# EAGLE design eled01 (EAGLE 7.2.0)
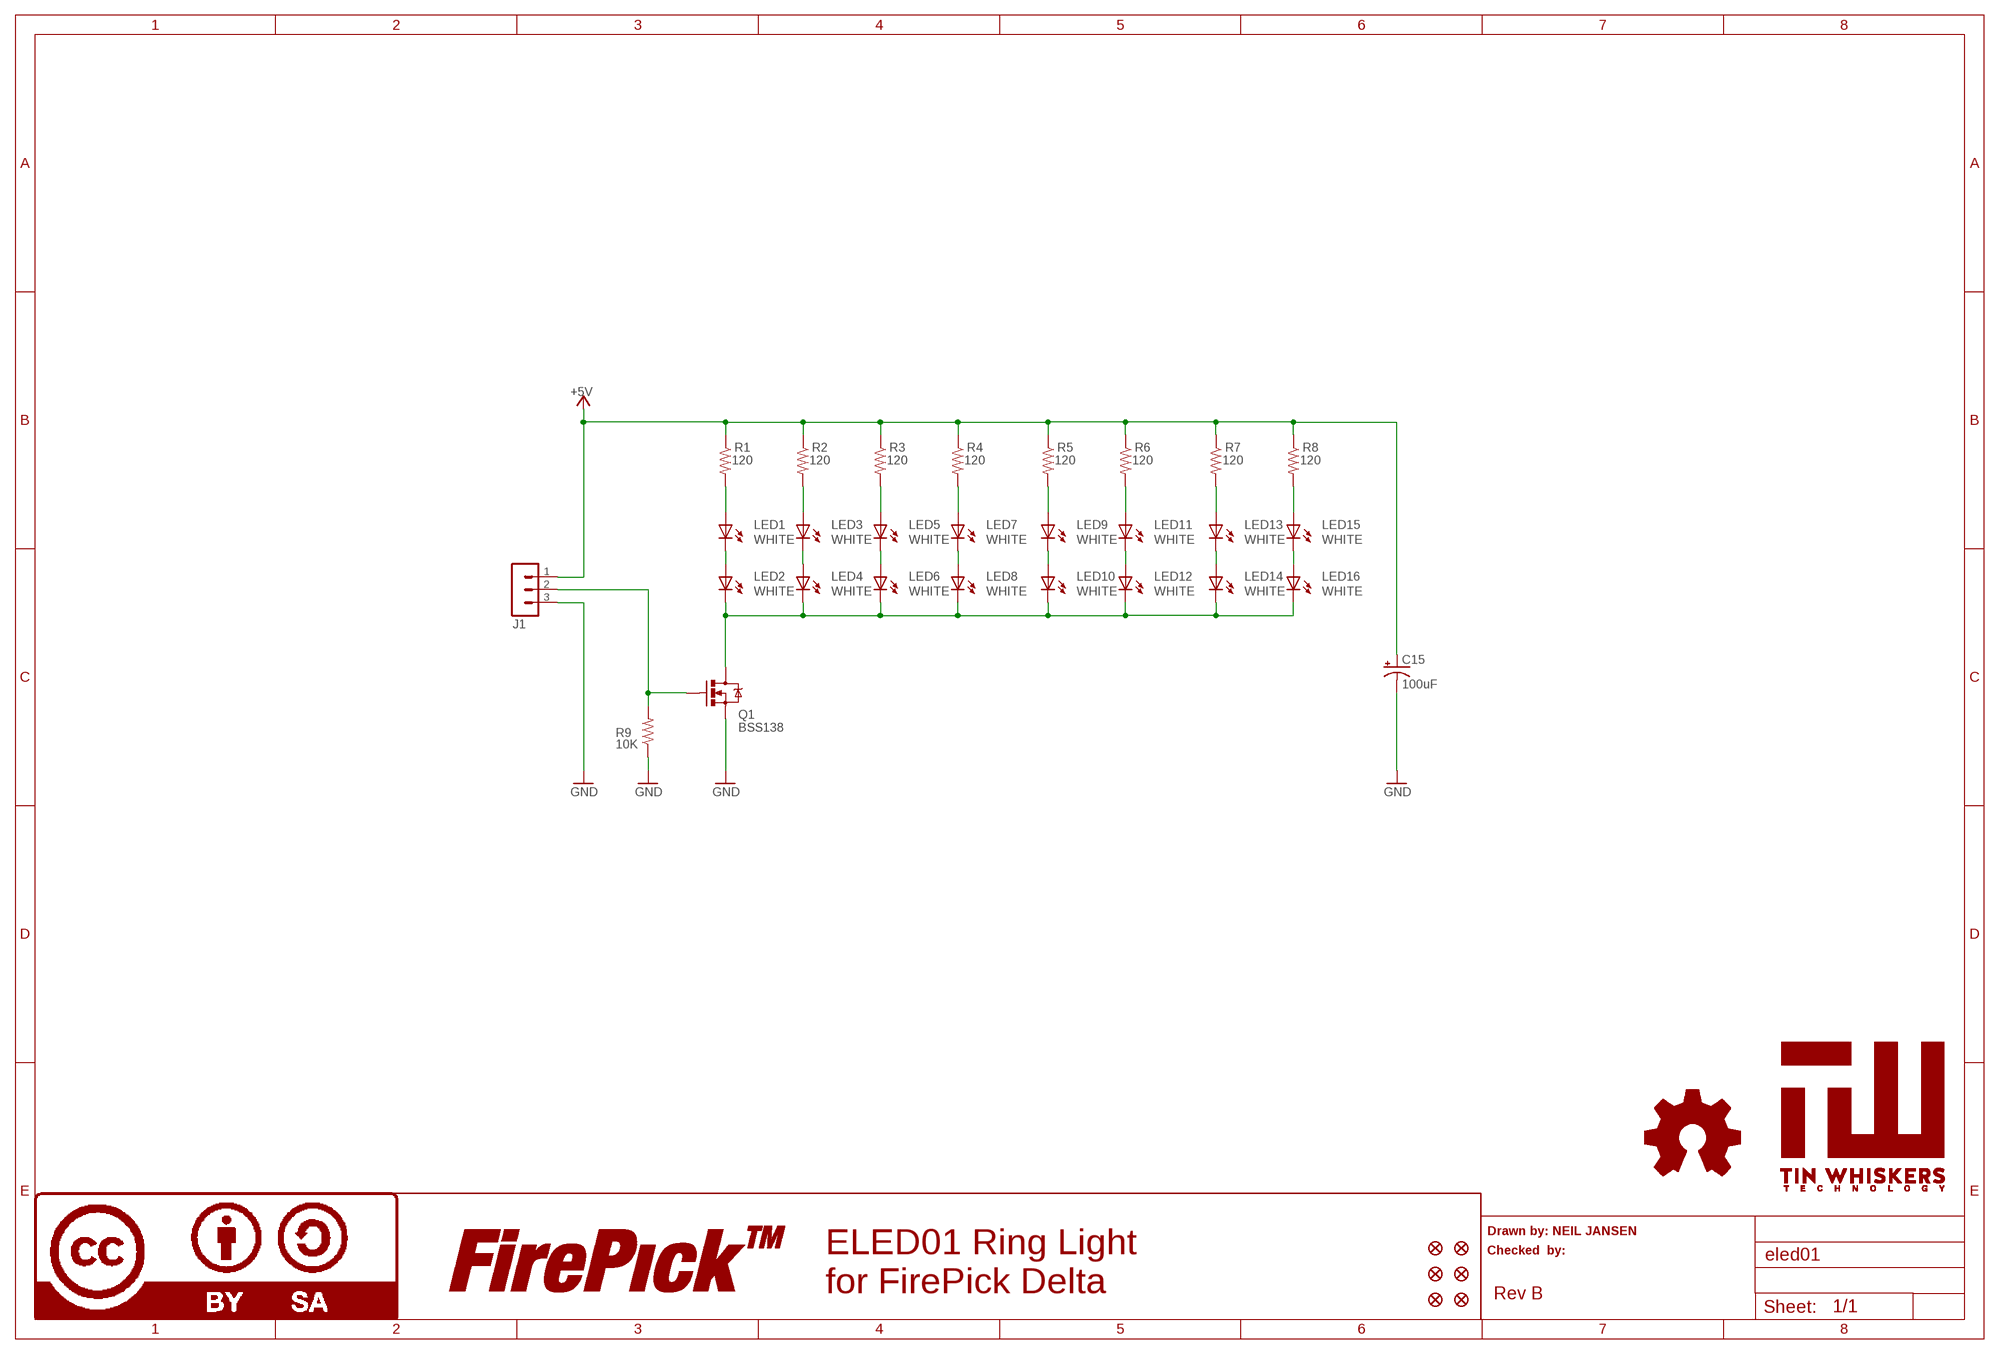
[diagram p0: schematic, sheet 1]

## Parts
C15  100uF  CPOL-USD  [PANASONIC_D]
FID1  FIDUCIAL  [FIDUCIAL]
FID2  FIDUCIAL  [FIDUCIAL]
FID3  FIDUCIAL  [FIDUCIAL]
FID4  FIDUCIAL  [FIDUCIAL]
FID5  FIDUCIAL  [FIDUCIAL]
FID6  FIDUCIAL  [FIDUCIAL]
J1  MA03-1  [MA03-1]
LED1  WHITE  LED1206-NS  [LED-1206-NO_SILK]
LED2  WHITE  LED1206-NS  [LED-1206-NO_SILK]
LED3  WHITE  LED1206-NS  [LED-1206-NO_SILK]
LED4  WHITE  LED1206-NS  [LED-1206-NO_SILK]
LED5  WHITE  LED1206-NS  [LED-1206-NO_SILK]
LED6  WHITE  LED1206-NS  [LED-1206-NO_SILK]
LED7  WHITE  LED1206-NS  [LED-1206-NO_SILK]
LED8  WHITE  LED1206-NS  [LED-1206-NO_SILK]
LED9  WHITE  LED1206-NS  [LED-1206-NO_SILK]
LED10  WHITE  LED1206-NS  [LED-1206-NO_SILK]
LED11  WHITE  LED1206-NS  [LED-1206-NO_SILK]
LED12  WHITE  LED1206-NS  [LED-1206-NO_SILK]
LED13  WHITE  LED1206-NS  [LED-1206-NO_SILK]
LED14  WHITE  LED1206-NS  [LED-1206-NO_SILK]
LED15  WHITE  LED1206-NS  [LED-1206-NO_SILK]
LED16  WHITE  LED1206-NS  [LED-1206-NO_SILK]
LOGO2  LOGO-OSHWSMALL  [LOGO-OSHW-SMALL]
LOGO4  LOGO-FIREPICKMEDIUM  [LOGO-FIREPICK-MEDIUM]
LOGO6  LOGO-CC-BY-SAMEDIUM  [LOGO-CC-BY-SA-MEDIUM]
Q1  BSS138  MOSFET-NCHANNELBSS138  [SOT23]
R1  120  RESISTOR0805-RES  [0805]
R2  120  RESISTOR0805-RES  [0805]
R3  120  RESISTOR0805-RES  [0805]
R4  120  RESISTOR0805-RES  [0805]
R5  120  RESISTOR0805-RES  [0805]
R6  120  RESISTOR0805-RES  [0805]
R7  120  RESISTOR0805-RES  [0805]
R8  120  RESISTOR0805-RES  [0805]
R9  10K  RESISTOR0805-RES  [0805]
U$1  TIN-WHISKERSSMALL  [TIN-WHISKERS-SMALL]

## Nets
+5V [power]: C15.+ J1.1 R1.1 R2.1 R3.1 R4.1 R5.1 R6.1 R7.1 R8.1
DRAIN: LED2.C LED4.C LED6.C LED8.C LED10.C LED12.C LED14.C LED16.C Q1.3(D)
ENABLE1: J1.2 Q1.1(G) R9.2
GND [power]: C15.- J1.3 Q1.2(S) R9.1
N$1: LED1.C LED2.A
N$3: LED3.C LED4.A
N$4: LED7.C LED8.A
N$6: LED7.A R4.2
N$7: LED3.A R2.2
N$8: LED5.A R3.2
N$9: LED9.A R5.2
N$11: LED11.A R6.2
N$12: LED9.C LED10.A
N$13: LED5.C LED6.A
N$14: LED11.C LED12.A
N$17: LED13.C LED14.A
N$19: LED15.C LED16.A
N$20: LED13.A R7.2
N$21: LED15.A R8.2
N$22: LED1.A R1.2

## Notes on the sheet
- Drawn by: NEIL JANSEN
- Checked  by:
- ELED01 Ring Light
  for FirePick Delta
- Rev B

## Library data of the parts
C15 = rcl:CPOL-US: POLARIZED CAPACITOR, American symbol; PARTNO: 25TXV100M6.3X8
FID1-FID6 = FirePick:FIDUCIAL; DNP: T
J1 = !con-lstb:MA03-1: PIN HEADER; PARTNO: CONN-0.1-RA-1X3
LED1-LED16 = SparkFun-LED:LED: LEDs Standard schematic elements and footprints for 5mm, 3mm, 1206, and 0603 sized LEDs. 5mm - Spark Fun Electronics SKU : COM-00529 (and others); PARTNO: LTST-C150CKT
LOGO2 = FirePick:LOGO-OSHW; BOM: EXCLUDE; DNP: T
LOGO4 = FirePick:LOGO-FIREPICK; BOM: EXCLUDE; DNP: T
LOGO6 = FirePick:LOGO-CC-BY-SA; BOM: EXCLUDE; DNP: T
Q1 = SparkFun-DiscreteSemi:MOSFET-NCHANNEL: Common NMOSFET Parts MFG P/N Store ID Prod ID FDD8780 TRANS-09984 SI7820DN TRANS-11055 FDS6630A IC-08089 2N7002PW TRANS-11151 FQP30N06L COM-10213 TRANS-10060 BSS123LT1G TRANS-08345 BSS138 TRANS-00830 BS170 2N7000; PARTNO: BSS138; PROD_ID: TRANS-00830
R1-R8 = SparkFun-Resistors:RESISTOR: Resistor Basic schematic elements and footprints for 0603, 1206, and PTH resistors.; PARTNO: RC0805FR-07120RL
R9 = SparkFun-Resistors:RESISTOR: Resistor Basic schematic elements and footprints for 0603, 1206, and PTH resistors.; PARTNO: RC0805FR-0710KL
U$1 = !tin-whiskers:TIN-WHISKERS

## Net classes
0 default: width 0.3 mm, drill 0.3 mm, clearance 0.3 mm
2 power-12V: width 0.3 mm, drill 0.3 mm, clearance 0.3 mm

## Board
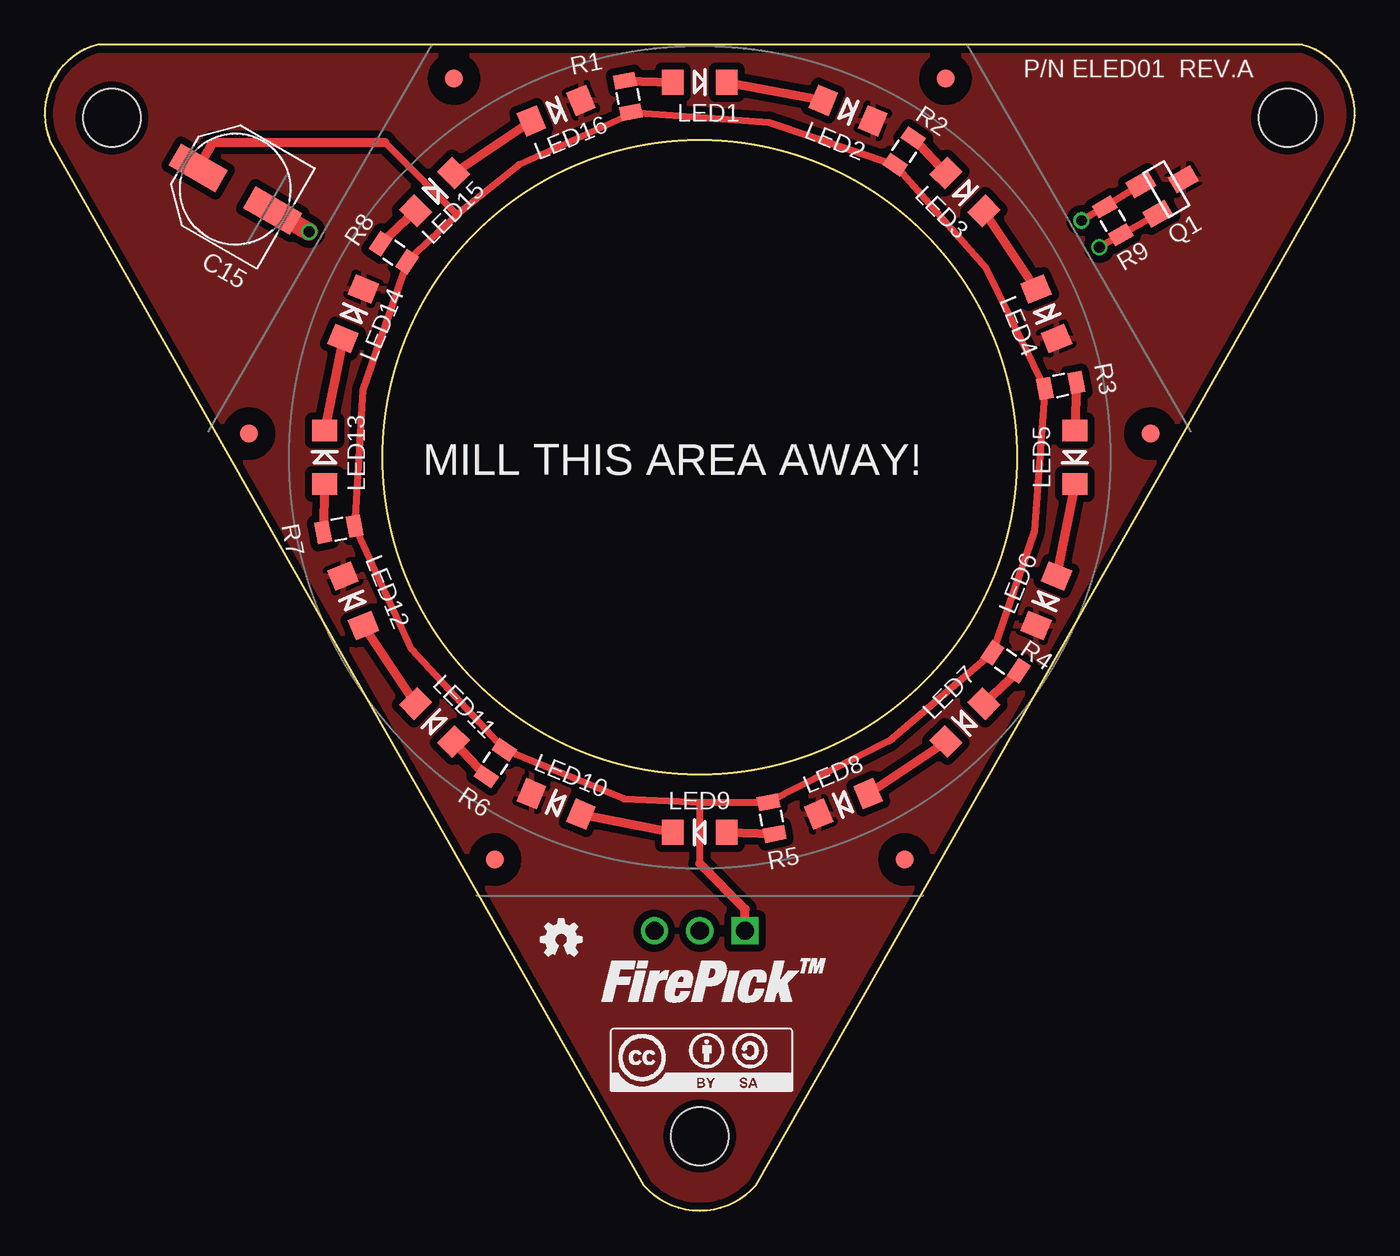
[diagram p1: board, top side]
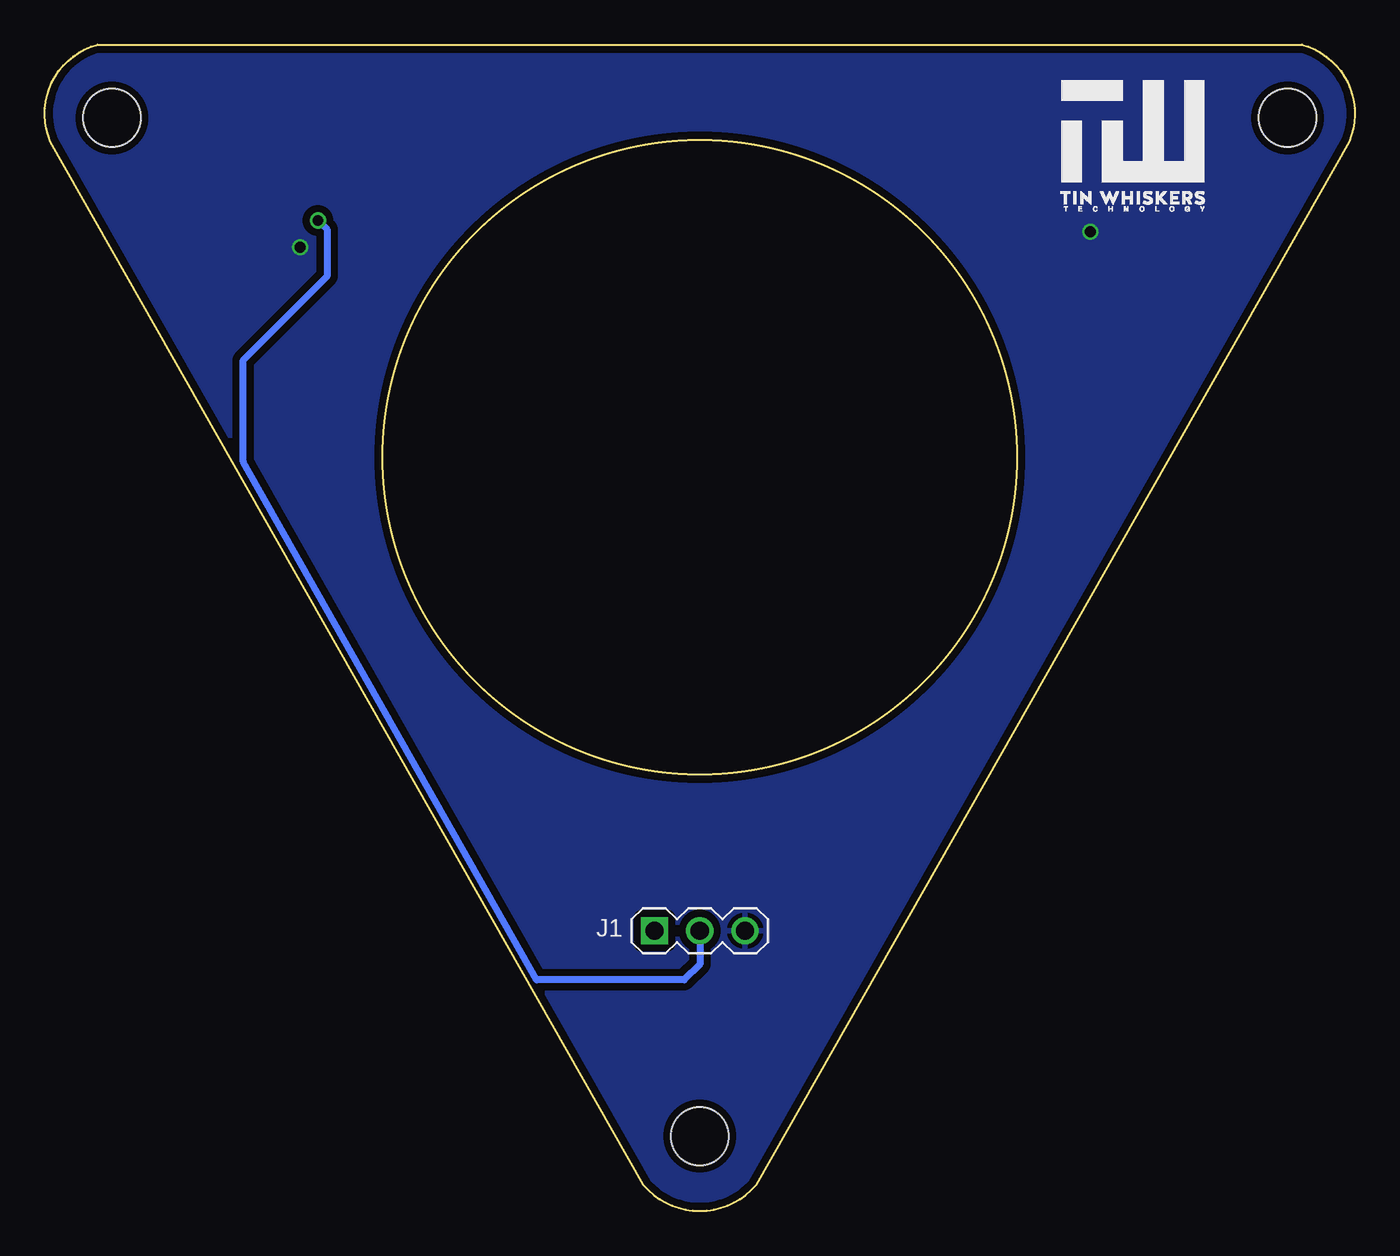
[diagram p2: board, bottom side, seen from below]

Size 73.36 x 65.27 mm. Coordinates in mm from the lower left corner, seen from the top.
Outline: 39.82,1.43 73.04,59.84 arc98 70.4,65.27 2.96,65.27 arc98 0.32,59.84 33.54,1.43 arc98 39.82,1.43
Outline: circle at 36.68,42.18 radius 17.75
Copper layers (1*16): Top 0.035mm / dielectric 1.5mm / Bottom 0.035mm
Design rules "SeeedStudio_2layer_DRU_no_angle_20140221": minimum track width 6mil, minimum drill 12mil, track to track 6mil, track to pad 6mil, pad to pad 6mil, via to via 6mil, smd to smd 0mil, copper to edge 10mil, drill to drill 10mil, minimum pad ring 10mil, minimum via ring 6mil, stop-mask expansion 2mil, vias tented up to drill 100mil, thermal gap 10mil
Holes 3.25 mm at 36.68,4.18 3.77,61.18 69.59,61.18

### Footprints (pad centres in the part's own frame; a part is rotated, then mirrored left to right if it is on the bottom)
PANASONIC_D = smd 3 x 1.4: + 2.4,0; - -2.4,0
FIDUCIAL = smd 1 x 1: 1 0,0
MA03-1 = drill 1.016 square: 1 -2.54,0 | drill 1.016: 2 0,0; 3 2.54,0
LED-1206-NO_SILK = smd 1.2 x 1.4: A -1.5,0; C 1.5,0
SOT23 = smd 1 x 1.4: 1 -0.95,-1.1; 2 0.95,-1.1; 3 0,1.1
0805 = smd 0.8 x 1.2: 1 -0.9,0; 2 0.9,0

### Placement (x,y rotation side)
C15  10.68,57.18 150 top
FID1  48.15,19.67 0 top
FID2  11.45,43.5 0 top
FID3  61.91,43.5 0 top
FID4  25.21,19.67 0 top
FID5  22.92,63.37 0 top
FID6  50.44,63.37 0 top
J1  36.68,15.68 0 bottom
LED1  36.68,63.18 0 top
LED2  44.99,61.58 337.5 top
LED3  51.53,57.03 315 top
LED4  56.08,50.22 292.5 top
LED5  57.68,42.18 270 top
LED6  56.08,34.14 247.5 top
LED7  51.53,27.33 225 top
LED8  44.72,22.78 202.5 top
LED9  36.68,21.18 180 top
LED10  28.64,22.78 157.5 top
LED11  21.83,27.33 135 top
LED12  17.28,34.14 112.5 top
LED13  15.68,42.18 90 top
LED14  17.28,50.22 67.5 top
LED15  21.83,57.03 45 top
LED16  28.64,61.58 22.5 top
LOGO2  27.68,14.06 0 top
LOGO4  31.18,11.68 0 top
LOGO6  31.68,6.68 0 top
Q1  62.81,57.18 300 top
R1  32.66,62.38 101 top
R2  48.12,59.31 56 top
R3  56.88,46.2 11 top
R4  53.81,30.74 326 top
R5  40.7,21.98 281 top
R6  25.24,25.06 236 top
R7  16.48,38.16 191 top
R8  19.56,53.62 146 top
R9  59.81,55.42 120 top
U$1  16.93,55.68 0 bottom

### Tracks (layer width: path | path; a pad name or v marks a point on that pad's centre or on a via)
+5V
  Top 0.3: 23.09,55.74 23.19,55.83 | 32.83,61.38 32.83,61.39 R1.1 32.9,61.43 32.93,61.43
  Top 0.4: R1.1 40.56,60.93 R2.1 52.68,52.81 R3.1 55.43,38.06 R4.1 47.31,26.31 R5.1 36.78,22.86 | R8.1 17.81,45.93 R7.1 20.56,31.43 R6.1 32.43,23.06 36.78,22.86 | 32.93,61.43 26.56,58.56 23.19,55.83 | 36.68,19.43 36.68,22.83 36.78,22.86 | 20.18,53.06 23.09,55.74 19.04,59.81
  Top 0.5: J1.1 39.22,16.89 36.68,19.43 | C15.+ 9.43,59.81 19.04,59.81
DRAIN
  pour Top (isolate 0.406, rank 2): 2.93,65.31 70.43,65.31 71.81,64.81 72.68,63.93 73.43,62.43 73.43,60.68 73.06,59.68 39.81,1.31 38.81,0.56 37.56,0.06 36.31,-0.07 34.93,0.31 33.93,1.06 33.43,1.56 0.31,59.93 0.06,60.81 -0.07,61.93 0.31,63.06 1.06,64.18 1.93,64.93
ENABLE1  (via drill 0.6)
  Top 0.4: v58.06,55.43 R9.2 Q1.1
  Bottom 0.4: J1.2 36.68,13.81 37.56,12.93 45.81,12.93 62.24,41.93 62.24,47.62 57.56,52.31 57.56,54.93 v58.06,55.43
GND  (via drill 0.6)
  Top 0.4: Q1.2 R9.1 v59.06,53.93
  Top 1: C15.- v14.81,54.81
  pour Bottom (isolate 0.406, rank 2): 3.06,65.31 70.43,65.31 71.81,64.81 72.68,63.93 73.43,62.43 73.43,60.68 73.06,59.68 39.81,1.31 38.81,0.56 37.56,0.06 36.31,-0.07 34.93,0.31 33.93,1.06 33.43,1.56 0.31,59.93 0.06,60.81 -0.07,61.93 0.31,63.06 1.06,64.18 1.93,64.93
N$1
  Top 0.5: LED1.C LED2.A
N$3
  Top 0.5: LED3.C LED4.A
N$4
  Top 0.5: LED7.C LED8.A
N$6
  Top 0.5: R4.2 LED7.A
N$7
  Top 0.5: R2.2 LED3.A
N$8
  Top 0.5: R3.2 LED5.A
N$9
  Top 0.5: LED9.A R5.2
N$11
  Top 0.5: LED11.A R6.2
N$12
  Top 0.5: LED10.A LED9.C
N$13
  Top 0.5: LED5.C LED6.A
N$14
  Top 0.5: LED12.A LED11.C
N$17
  Top 0.5: LED14.A LED13.C
N$19
  Top 0.5: LED16.A LED15.C
N$20
  Top 0.5: LED13.A R7.2
N$21
  Top 0.5: LED15.A R8.2
N$22
  Top 0.5: R1.2 LED1.A

### Text on the board
tPlace: P/N ELED01 REV.A | MILL THIS AREA AWAY!